# Altium schematic sheet power.SchDoc
size A4
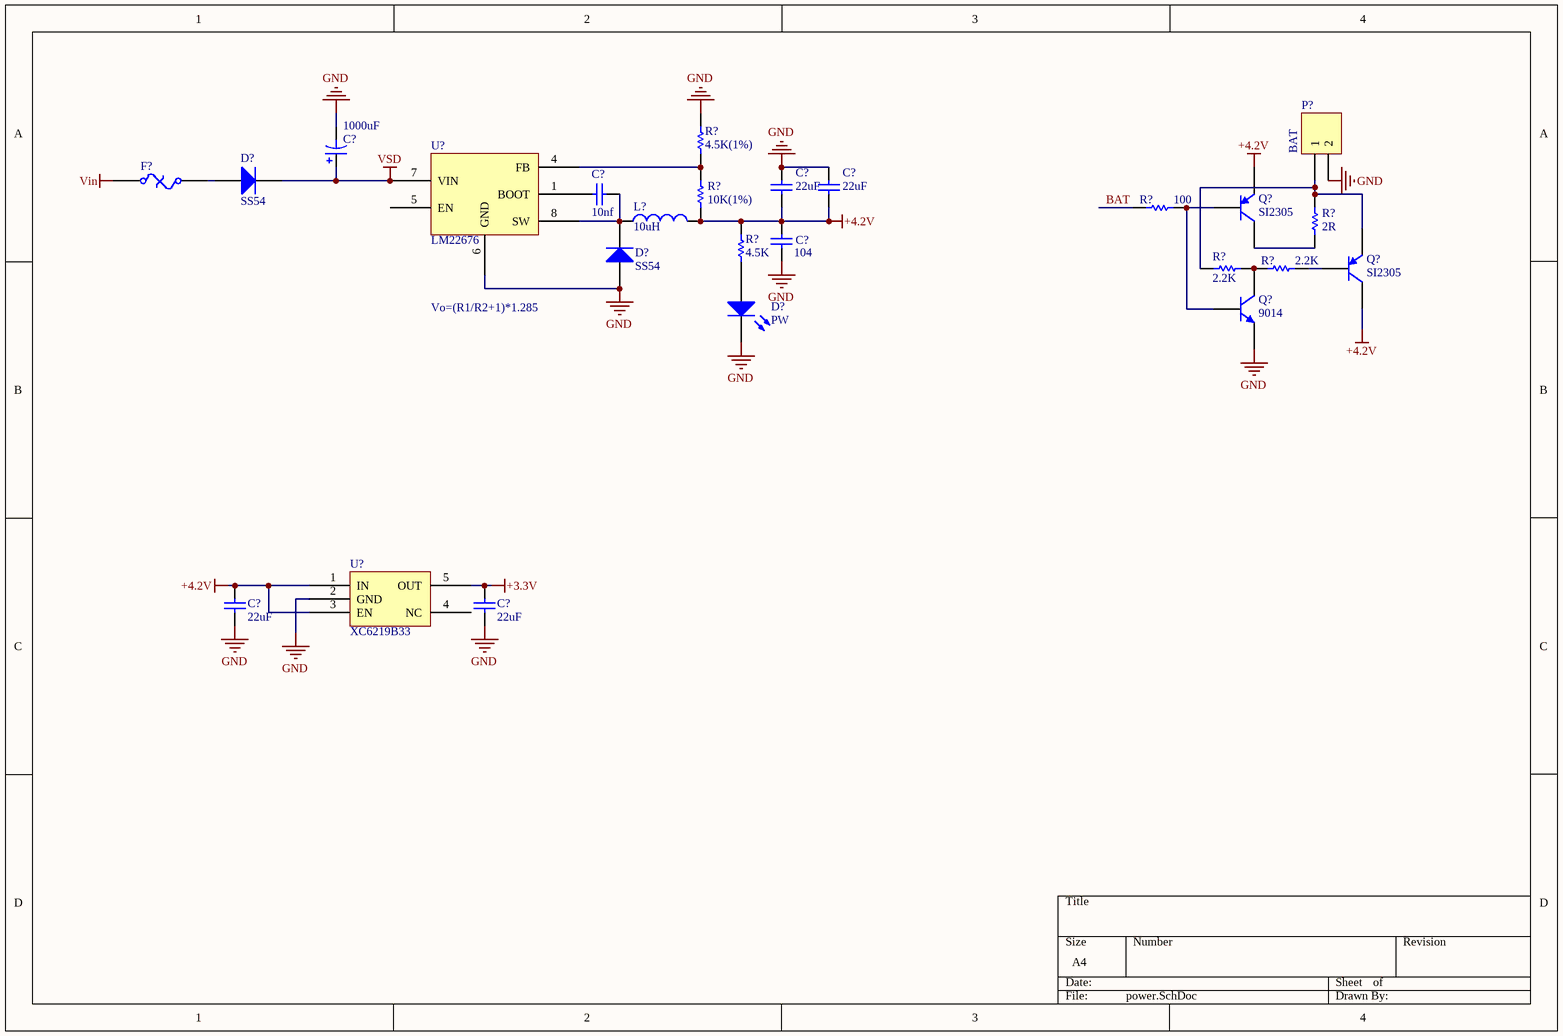
[diagram p0: power.SchDoc]

## Parts
(Parts that share a designator on the sheet are numbered #1, #2 ... from top to bottom, then left to right.)
C?#1  value 1000uF  [C10-SMD]  (hidden comment: Cap Pol3)
C?#2  value 22uF  [3216[1206]]  (hidden comment: Cap)
C?#3  value 22uF  [3216[1206]]  (hidden comment: Cap)
C?#4  value 10nf  [0603]  (hidden comment: Cap)
C?#5  value 104  [0603]  (hidden comment: Cap)
C?#6  value 22uF  [R0805]  (hidden comment: Cap)
C?#7  value 22uF  [R0805]  (hidden comment: Cap)
D?#1  SS54  [SMA]
D?#2  SS54  [SMA]
D?#3  PW  [0603-LED]
F?  Fuse Thermal  [PPTC-5.8]  (value not drawn)
L?  value 10uH  [L-6045]  (hidden comment: Inductor)
P?  BAT  [PH2.0-2P]
Q?#1  value SI2305  [SOT-23-PNP]  (hidden comment: PNP)
Q?#2  value SI2305  [SOT-23-PNP]  (hidden comment: PNP)
Q?#3  value 9014  [SOT-23-NPN]  (hidden comment: NPN)
R?#1  value 4.5K(1%)  [0603]  (hidden comment: Res1)
R?#2  value 10K(1%)  [0603]  (hidden comment: Res1)
R?#3  value 100  [0603]  (hidden comment: Res1)
R?#4  value 4.5K  [0603]  (hidden comment: Res1)
R?#5  value 2R  [3216[1206]]  (hidden comment: Res1)
R?#6  value 2.2K  [0603]  (hidden comment: Res1)
R?#7  value 2.2K  [0603]  (hidden comment: Res1)
U?#1  LM22676  [SOP8-POW]
U?#2  XC6219B33  [SOT23-5N]

## Nets
+3.3V: C?#7.1 U?#2.5(OUT)
+4.2V: C?#2.2 C?#3.2 C?#5.2 C?#6.1 L?.2 Q?#1.1(E) Q?#2.3(C) R?#2.1 R?#4.1 U?#2.1(IN) U?#2.3(EN)
GND: C?#1.2 C?#2.1 C?#3.1 C?#5.1 C?#6.2 C?#7.2 D?#2.1(A) D?#3.2(K) P?.2 Q?#3.1(E) R?#1.1 U?#1.6(GND) U?#1.9 U?#2.2(GND)
Vin: F?.1
VSD: C?#1.1 D?#1.2(K) U?#1.7(VIN)
BAT: R?#3.2
NetC?#4_1: C?#4.1 D?#2.2(K) L?.1 U?#1.8(SW)
NetC?#4_2: C?#4.2 U?#1.1(BOOT)
NetD?#1_1: D?#1.1(A) F?.2
NetD?#3_1: D?#3.1(A) R?#4.2
NetP?_1: P?.1 Q?#2.1(E) R?#5.2 R?#6.1
NetQ?#1_2: Q?#1.2(B) Q?#3.2(B) R?#3.1
NetQ?#1_3: Q?#1.3(C) R?#5.1
NetQ?#2_2: Q?#2.2(B) R?#7.1
NetQ?#3_3: Q?#3.3(C) R?#6.2 R?#7.2
NetR?#1_2: R?#1.2 R?#2.2 U?#1.4(FB)

Not connected (* = marked no-connect by the designer): U?#1 2(NC) 3(NC) 5(EN); U?#2 4(NC)

## Notes on the sheet
- Vo=(R1/R2+1)*1.285

## Library data of the parts
C?#1 = Cap Pol3: Polarized Capacitor (Surface Mount); Published: 8-Jun-2000; LatestRevisionDate: 17-Jul-2002; LatestRevisionNote: Re-released for DXP Platform.; PackageReference: C0805; Publisher: Altium Limited
C?#2-C?#7 = Cap: Capacitor; Published: 8-Jun-2000; LatestRevisionDate: 17-Jul-2002; LatestRevisionNote: Re-released for DXP Platform.; PackageReference: RAD-0.3; Publisher: Altium Limited
D?#1 D?#2 = Diode 1N5408: 3 Amp Medium Power Silicon Rectifier Diode; Published: 8-Jun-2000; LatestRevisionDate: 17-Jul-2002; LatestRevisionNote: Re-released for DXP Platform.; DatasheetDocument: Aug-1984; PackageReference: DO-201AD; Publisher: Altium Limited; ComponentLink1Description: Manufacturer Link; ComponentLink1URL: http://www.irf.com/; Value: SS54
D?#3 = LED2: Typical RED, GREEN, YELLOW, AMBER GaAs LED; Published: 8-Jun-2000; LatestRevisionDate: 17-Jul-2002; LatestRevisionNote: Re-released for DXP Platform.; PackageDocument: Feb-2002; PackageReference: 3.2X1.6X1.1; Publisher: Altium Limited; Value: RED
F? = Fuse Thermal: Thermal Fuse; Published: 24-Mar-1999; LatestRevisionDate: 17-Jul-2002; LatestRevisionNote: Re-released for DXP Platform.; PackageReference: PIN-W2/E2.8; Publisher: Altium Limited
L? = Inductor: Code_IEC: 1005; Published: 8-Jun-2000; LatestRevisionDate: 17-Jul-2002; LatestRevisionNote: Re-released for DXP Platform.; PackageReference: 0402-A; Publisher: Altium Limited; Code_JEITA: 0402
P? = Header 2: Header, 2-Pin; LatestRevisionDate: 17-Jul-2002; LatestRevisionNote: Re-released for DXP Platform.; Publisher: Altium Limited
Q?#1 Q?#2 = 2N5401: PNP General Purpose Amplifier; Published: 8-Jun-2000; LatestRevisionDate: 17-Jan-2003; LatestRevisionNote: PCB Footprint 'BCY-W3/D4.7' replaced; DatasheetDocument: 1997; PackageDocument: Sep-1998; PackageReference: TO-92A; Publisher: Altium Limited; ComponentLink1Description: Manufacturer Link; ComponentLink1URL: http://www.fairchildsemi.com/; ComponentLink2Description: Datasheet; ComponentLink2URL: http://www.fairchildsemi.com/ds/2N%2F2N5401.pdf
Q?#3 = 2N5551: NPN General Purpose Amplifier; Published: 8-Jun-2000; LatestRevisionDate: 17-Jan-2003; LatestRevisionNote: PCB Footprint 'BCY-W3/D4.7' replaced; DatasheetDocument: 1997; PackageDocument: Sep-1998; PackageReference: TO-92A; Publisher: Altium Limited; ComponentLink1Description: Manufacturer Link; ComponentLink1URL: http://www.fairchildsemi.com/; ComponentLink2Description: Datasheet; ComponentLink2URL: http://www.fairchildsemi.com/ds/2N%2F2N5551.pdf
R?#1-R?#7 = Res1: Resistor; Published: 8-Jun-2000; LatestRevisionDate: 17-Jul-2002; LatestRevisionNote: Re-released for DXP Platform.; PackageReference: AXIAL-0.3; Publisher: Altium Limited
U?#1 = LM22676-5.0
U?#2 = LP5907: Value: LP5907